# EAGLE design ATtiny841_StepperTesting_Packaged (EAGLE 7.5.0)
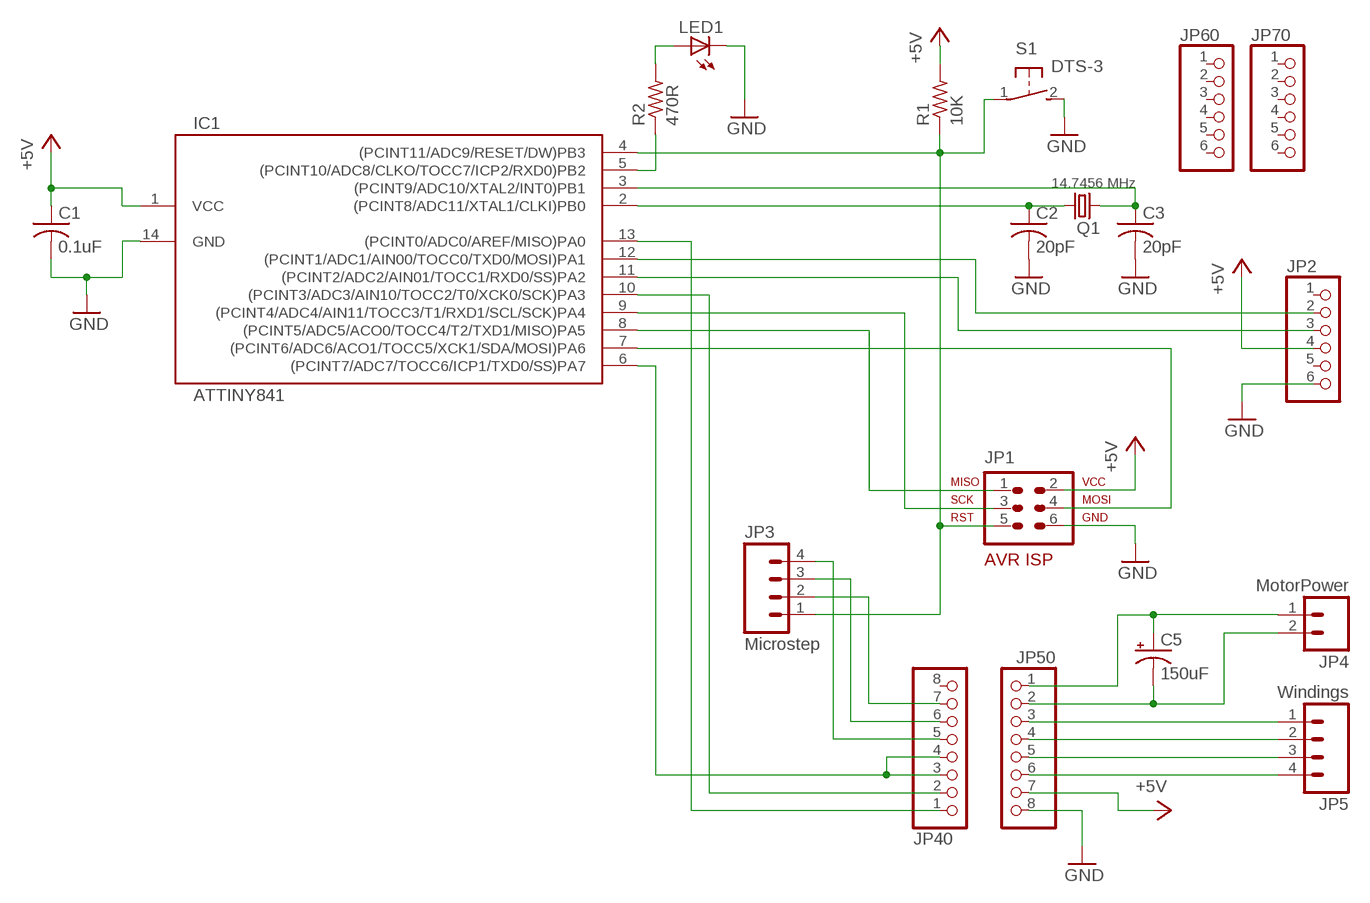
[diagram p0: schematic, sheet 1]

## Parts
C1  0.1uF  C025  [C025-024X044]
C2  20pF  C025  [C025-024X044]
C3  20pF  C025  [C025-024X044]
C5  150uF  CPOL-USE7.5-18  [E7,5-18]
IC1  ATTINY841  ATTINY441/841-SSU  [SOIC14]
JP1  AVR-ISP-6VERT  [AVR-ISP-6]
JP2  PINHD-1X6CB  [1X06-CLEANBIG]
JP3  Microstep  M04POLAR  [MOLEX-1X4]
JP4  MotorPower  M02POLAR  [MOLEX-1X2]
JP5  Windings  M04POLAR  [MOLEX-1X4]
JP40  PINHD-1X8CLEANBIG  [1X08-CLEANBIG]
JP50  PINHD-1X8CLEANBIG  [1X08-CLEANBIG]
JP60  PINHD-1X6CB  [1X06-CLEANBIG]
JP70  PINHD-1X6CB  [1X06-CLEANBIG]
LED1  LED5MM  [LED5MM]
Q1  14.7456 MHz  CRYSTALHC49S  [HC49/S]
R1  10K  R-US_0207/7  [0207/7]
R2  470R  R-US_0207/7  [0207/7]
S1  DTS-3  [DTS-3]

## Nets
+5V: C1.1 IC1.1(VCC) JP1.2 JP2.4 JP50.7 R1.2
DIR: IC1.13((PCINT0/ADC0/AREF/MISO)PA0) JP40.1
GND: C1.2 C2.2 C3.2 IC1.14(GND) JP1.6 JP2.6 JP50.8 LED1.K(C) S1.2
MISO: IC1.8((PCINT5/ADC5/ACO0/TOCC4/T2/TXD1/MISO)PA5) JP1.1
MOSI: IC1.7((PCINT6/ADC6/ACO1/TOCC5/XCK1/SDA/MOSI)PA6) JP1.4
MOT-RET: C5.- JP4.2 JP50.2
N$1: JP3.4 JP40.5
N$2: JP3.3 JP40.6
N$3: JP3.2 JP40.7
N$9: JP5.1 JP50.3
N$11: LED1.A R2.2
N$12: JP5.2 JP50.4
N$13: JP5.3 JP50.5
N$14: JP5.4 JP50.6
PB2: IC1.5((PCINT10/ADC8/CLKO/TOCC7/ICP2/RXD0)PB2) R2.1
RST: IC1.4((PCINT11/ADC9/RESET/DW)PB3) JP1.5 JP3.1 R1.1 S1.1
RXD0: IC1.11((PCINT2/ADC2/AIN01/TOCC1/RXD0/SS)PA2) JP2.3
SCK: IC1.9((PCINT4/ADC4/AIN11/TOCC3/T1/RXD1/SCL/SCK)PA4) JP1.3
SLEEP: IC1.6((PCINT7/ADC7/TOCC6/ICP1/TXD0/SS)PA7) JP40.3 JP40.4
STEP: IC1.10((PCINT3/ADC3/AIN10/TOCC2/T0/XCK0/SCK)PA3) JP40.2
TXD0: IC1.12((PCINT1/ADC1/AIN00/TOCC0/TXD0/MOSI)PA1) JP2.2
VMOT: C5.+ JP4.1 JP50.1
XTAL1: C3.1 IC1.3((PCINT9/ADC10/XTAL2/INT0)PB1) Q1.1
XTAL2: C2.1 IC1.2((PCINT8/ADC11/XTAL1/CLKI)PB0) Q1.2
Unconnected: JP2.1 JP2.5 JP40.8 JP60.1 JP60.2 JP60.3 JP60.4 JP60.5 JP60.6 JP70.1 JP70.2 JP70.3 JP70.4 JP70.5 JP70.6

## Library data of the parts
C1-C3 = au:C025
C5 = adafruit:CPOL-US: POLARIZED CAPACITOR, American symbol
IC1 = bog-thoughts_AVR:ATTINY441/841: ATtiny441, ATtiny841 AVR Microcontroller The high-performance Atmel picoPower 8-bit AVR RISC-based microcontroller combines 4KB ISP flash memory, 512-Byte EEPROM, 128B SRAM, 12 general purpose I/O lines, 32 general purpose working registers, an 8-bit timer/counter with two PWM channels, two 16-bit timer/counters with two PWM channels, internal and external interrupts, an 12-channel 10-bit A/D converter, 2 On-chip analog comparators, 2 full duplex USARTs with Start Frame wake up from power down, master/slave SPI serial interface, slave I2C serial interface, programmable gain stage (1x, 20x, and 100x) for 12 differential ADC channel pairs, programmable watchdog timer with internal oscillator, internal calibrated oscillator, and four software selectable power saving modes. The device operates between 1.7-5.5 volts. datasheet.pdf <http://www.atmel.com/Images/Atmel-8495-8-bit-AVR-Microcontrollers-ATtiny441-ATtiny841_Datasheet.pdf>
JP1 = avr-7:AVR-ISP-6: AVR ISP-6 Serial Programming Header
JP2 JP60 JP70 = adafruit:PINHD-1X6: PIN HEADER
JP3 JP5 = SparkFun-Connectors:M04: Header 4 Standard 4-pin 0.1" header. Use with straight break away headers (SKU : PRT-00116), right angle break away headers (PRT-00553), swiss pins (PRT-00743), machine pins (PRT-00117), and female headers (PRT-00115). Molex polarized connector foot print use with SKU : PRT-08231 with associated crimp pins and housings. 1MM SMD Version SKU: PRT-10208
JP4 = SparkFun-Connectors:M02: Standard 2-pin 0.1" header. Use with - straight break away headers ( PRT-00116) - right angle break away headers (PRT-00553) - swiss pins (PRT-00743) - machine pins (PRT-00117) - female headers (PRT-00115) Molex polarized connector foot print use with: PRT-08233 with associated crimp pins and housings. 2.54_SCREWTERM for use with PRT-10571. 3.5mm Screw Terminal footprints for PRT-08084 5mm Screw Terminal footprints for use with PRT-08432
JP40 JP50 = adafruit:PINHD-1X8: PIN HEADER
LED1 = adafruit:LED: LED OSRAM: - CHIPLED LG R971, LG N971, LY N971, LG Q971, LY Q971, LO R971, LY R971 LH N974, LH R974 LS Q976, LO Q976, LY Q976 LO Q996 - Hyper CHIPLED LW Q18S LB Q993, LB Q99A, LB R99A - SideLED LS A670, LO A670, LY A670, LG A670, LP A670 LB A673, LV A673, LT A673, LW A673 LH A674 LY A675 LS A676, LA A676, LO A676, LY A676, LW A676 LS A679, LY A679, LG A679 - Hyper Micro SIDELED® LS Y876, LA Y876, LO Y876, LY Y876 LT Y87S - SmartLED LW L88C, LW L88S LB L89C, LB L89S, LG L890 LS L89K, LO L89K, LY L89K LS L896, LA L896, LO L896, LY L896 - TOPLED LS T670, LO T670, LY T670, LG T670, LP T670 LSG T670, LSP T670, LSY T670, LOP T670, LYG T670 LG T671, LOG T671, LSG T671 LB T673, LV T673, LT T673, LW T673 LH T674 LS T676, LA T676, LO T676, LY T676, LB T676, LH T676, LSB T676, LW T676 LB T67C, LV T67C, LT T67C, LS T67K, LO T67K, LY T67K, LW E67C LS E67B, LA E67B, LO E67B, LY E67B, LB E67C, LV E67C, LT E67C LW T67C LS T679, LY T679, LG T679 LS T770, LO T770, LY T770, LG T770, LP T770 LB T773, LV T773, LT T773, LW T773 LH T774 LS E675, LA E675, LY E675, LS T675 LS T776, LA T776, LO T776, LY T776, LB T776 LHGB T686 LT T68C, LB T68C - Hyper Mini TOPLED® LB M676 - Mini TOPLED Santana® LG M470 LS M47K, LO M47K, LY M47K Source: http://www.osram.convergy.de/
Q1 = crystal:CRYSTAL: CRYSTAL; OC_FARNELL: 1667008; OC_NEWARK: unknown
R1 R2 = adafruit:R-US_: RESISTOR, American symbol
S1 = au:DTS-3

## Board
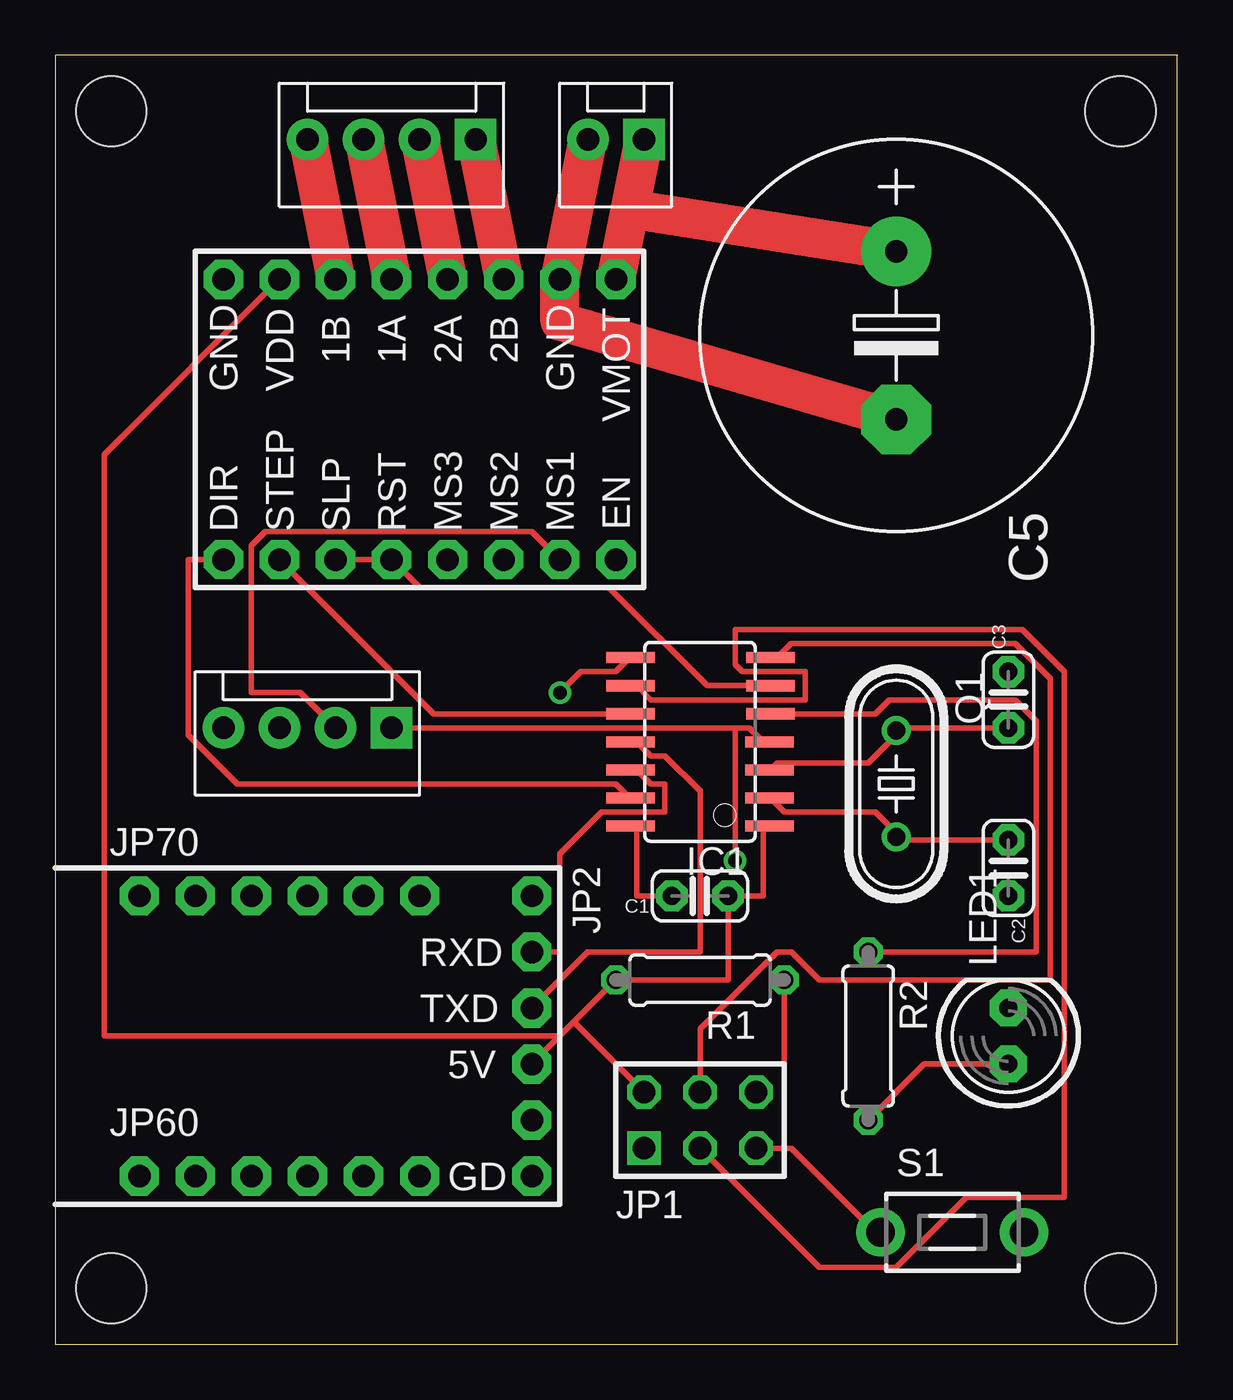
[diagram p1: board, top side]
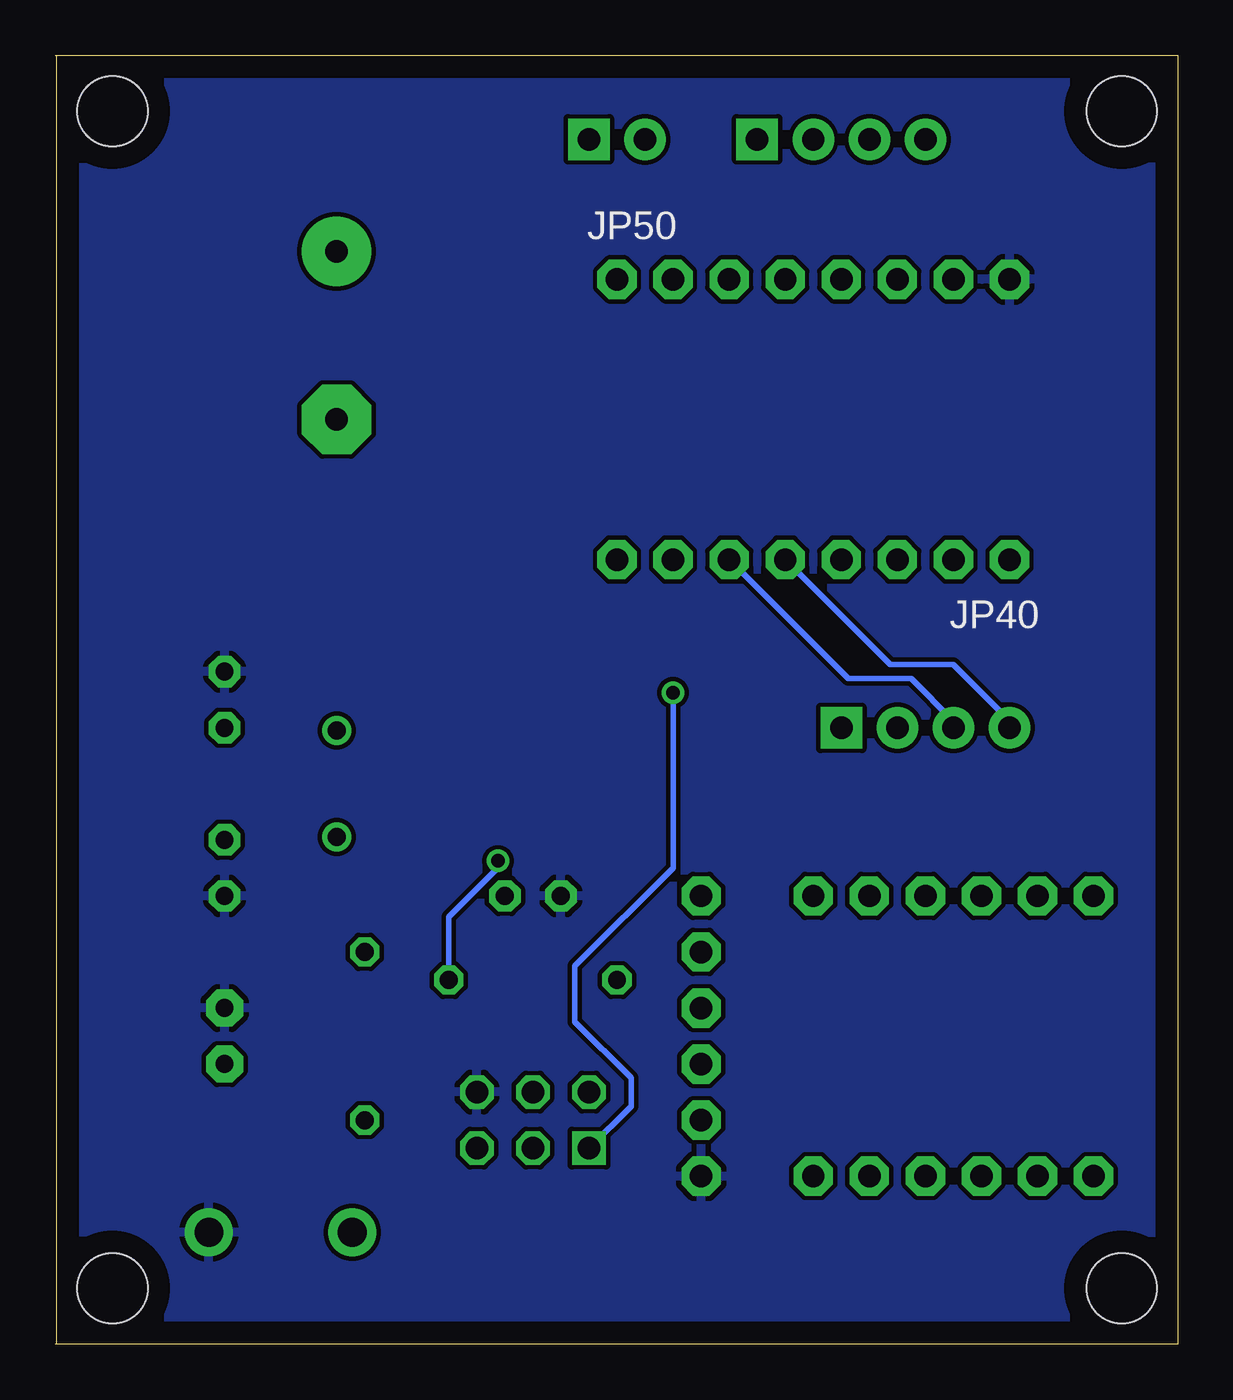
[diagram p2: board, bottom side, seen from below]

Size 50.85 x 58.42 mm. Coordinates in mm from the lower left corner, seen from the top.
Outline: 50.8,0 0,0 0,58.41 50.85,58.41
Outline: 50.8,0 50.85,0
Outline: 50.8,58.42 50.8,0
Copper layers (1*16): Top 0.035mm / dielectric 1.5mm / Bottom 0.035mm
Design rules "default *": minimum track width 10mil, minimum drill 24mil, track to track 8mil, track to pad 10mil, pad to pad 8mil, via to via 8mil, smd to smd 8mil, copper to edge 40mil, drill to drill 8mil, minimum pad ring 10mil, minimum via ring 8mil, stop-mask expansion 4mil, vias tented up to drill 0mil, thermal gap 10mil
Holes 3.17 mm at 2.54,2.54 2.54,55.88 48.26,2.54 48.26,55.88
vRestrict: 2 lines

### Footprints (pad centres in the part's own frame; a part is rotated, then mirrored left to right if it is on the bottom)
C025-024X044 = drill 0.813 pad 1.422 octagon: 1 -1.27,0; 2 1.27,0
E7,5-18 = drill 1.016 pad 3.15: + -3.81,0 | drill 1.016 pad 3.15 octagon: - 3.81,0
SOIC14 = smd 0.5 x 2.2: 1 -1.905,-3.154; 2 -0.645,-3.154; 3 0.625,-3.154; 4 1.895,-3.154; 5 3.175,-3.196; 6 4.445,-3.196; 7 5.715,-3.196; 8 5.715,3.154; 9 4.445,3.154; 10 3.175,3.154; 11 1.905,3.154; 12 0.635,3.154; 13 -0.635,3.154; 14 -1.905,3.154
AVR-ISP-6 = drill 1.016 square: 1 -2.54,-1.27 | drill 1.016 octagon: 2 -2.54,1.27; 3 0,-1.27; 4 0,1.27; 5 2.54,-1.27; 6 2.54,1.27
1X06-CLEANBIG = drill 1.016 pad 1.778 octagon: 1 -6.35,0; 2 -3.81,0; 3 -1.27,0; 4 1.27,0; 5 3.81,0; 6 6.35,0
MOLEX-1X4 = drill 1.016 pad 1.88 square: 1 0,0 | drill 1.016 pad 1.88: 2 2.54,0; 3 5.08,0; 4 7.62,0
MOLEX-1X2 = drill 1.016 pad 1.88 square: 1 0,0 | drill 1.016 pad 1.88: 2 2.54,0
1X08-CLEANBIG = drill 1.016 pad 1.778 octagon: 1 -8.89,0; 2 -6.35,0; 3 -3.81,0; 4 -1.27,0; 5 1.27,0; 6 3.81,0; 7 6.35,0; 8 8.89,0
LED5MM = drill 0.813 pad 1.676 octagon: A -1.27,0; K 1.27,0
HC49/S = drill 0.813: 1 -2.413,0; 2 2.413,0
0207/7 = drill 0.813 octagon: 1 -3.81,0; 2 3.81,0
DTS-3 = drill 1.3 pad 2.184: 1 -3.25,0; 2 3.25,0

### Placement (x,y rotation side)
C1  29.21,20.32 180 top
C2  43.18,21.59 270 top
C3  43.18,29.21 90 top
C5  38.1,45.72 270 top
IC1  29.21,25.4 90 top
JP1  29.21,10.16 0 top
JP2  21.59,13.97 270 top
JP3  15.24,27.94 180 top
JP4  26.67,54.61 180 top
JP5  19.05,54.61 180 top
JP40  16.51,35.56 180 bottom
JP50  16.51,48.26 0 bottom
JP60  10.16,7.62 0 top
JP70  10.16,20.32 0 top
LED1  43.18,13.97 90 top
Q1  38.1,25.4 270 top
R1  29.21,16.51 180 top
R2  36.83,13.97 270 top
S1  40.64,5.08 0 top

### Tracks (layer width: path | path; a pad name or v marks a point on that pad's centre or on a via)
+5V
  Top 0.254: IC1.1 32.07,23.5 32.07,20.32 C1.1 30.48,16.51 R1.2 23.5,14.61 | JP2.4 22.86,13.97 | 22.86,13.97 23.5,14.61 | 23.5,14.61 JP1.2 | JP50.7 2.22,40.32 2.22,13.97 22.86,13.97
DIR
  Top 0.254: JP40.1 6.03,35.56 6.03,27.62 8.26,25.4 25.4,25.4 26.04,24.77 IC1.13
GND
  Top 0.254: C1.2 26.35,20.32 26.35,23.5 IC1.14
  pour Bottom: 0,0 50.8,0 50.8,58.42 0,58.42
MISO  (via drill 0.61)
  Top 0.254: v22.86,29.53 23.81,30.48 25.4,30.48 26.04,31.11 IC1.8
  Bottom 0.254: v22.86,29.53 22.86,21.59 27.3,17.14 27.3,14.61 24.77,12.06 24.77,10.79 JP1.1
MOSI
  Top 0.254: JP1.4 29.21,14.29 32.7,17.78 33.34,17.78 34.61,16.51 45.09,16.51 45.09,30.16 43.5,31.75 33.34,31.75 32.7,31.11 IC1.7
MOT-RET
  Top 1.778: JP4.2 JP50.2 22.86,46.35 C5.-
N$1
  Bottom 0.254: JP40.5 13.02,30.8 10.16,30.8 7.62,28.26 JP3.4
N$2
  Bottom 0.254: JP40.6 14.92,30.16 12.06,30.16 10.16,28.26 JP3.3
N$3
  Top 0.254: JP40.7 21.59,36.83 9.53,36.83 8.89,36.2 8.89,29.53 11.11,29.53 JP3.2
N$9
  Top 1.778: JP5.1 JP50.3
N$11
  Top 0.254: R2.2 39.37,12.7 LED1.A
N$12
  Top 1.778: JP5.2 JP50.4
N$13
  Top 1.778: JP5.3 JP50.5
N$14
  Top 1.778: JP5.4 JP50.6
PB2
  Top 0.254: IC1.5 37.15,28.57 37.78,29.21 43.5,29.21 44.45,28.26 44.45,17.78 R2.1
RST  (via drill 0.61)
  Top 0.254: JP3.1 30.8,27.94 | 30.8,27.94 31.43,27.94 32.07,27.3 IC1.4 | 33.02,8.89 R1.1 | JP1.5 33.02,8.89 | 33.02,8.89 33.34,8.89 37.15,5.08 S1.1 | v30.8,21.91 30.8,27.94
  Bottom 0.254: v30.8,21.91 30.8,21.59 33.02,19.37 R1.1
RXD0
  Top 0.254: JP2.3 24.13,17.78 29.21,17.78 29.21,25.08 27.62,26.67 26.99,26.67 26.35,27.3 IC1.11
SCK
  Top 0.254: JP1.3 34.61,3.49 38.1,3.49 41.27,6.67 45.72,6.67 45.72,30.48 43.81,32.38 30.8,32.38 30.8,30.8 31.11,30.48 33.97,30.48 33.97,29.21 26.99,29.21 26.35,29.84 IC1.9
SLEEP
  Top 0.254: IC1.6 29.53,29.84 25.08,34.29 16.51,34.29 JP40.4 JP40.3
STEP
  Top 0.254: IC1.10 17.14,28.57 JP40.2
TXD0
  Top 0.254: JP2.2 22.86,17.78 22.86,22.23 24.77,24.13 27.62,24.13 27.62,25.4 26.99,25.4 26.35,26.04 IC1.12
VMOT
  Top 1.778: 26.04,51.44 JP50.1 | JP4.1 26.04,51.44 | C5.+ 26.04,51.44
XTAL1
  Top 0.254: IC1.3 32.38,26.04 32.7,26.35 36.83,26.35 38.1,27.62 Q1.1 38.1,27.94 C3.1
XTAL2
  Top 0.254: IC1.2 32.38,24.77 33.02,24.13 37.15,24.13 38.1,23.18 Q1.2 38.1,22.86 C2.1

### Text on the board
tNames: VMOT | 1B | 1A | 2A | 2B | GND | VDD | GND | EN | DIR | STEP | SLP | RST | MS3 | MS2 | MS1 | RXD | TXD | 5V | GD
tDocu: Pololu #1182 / A4988 Controller | 2015-12-05 Stepper Tester